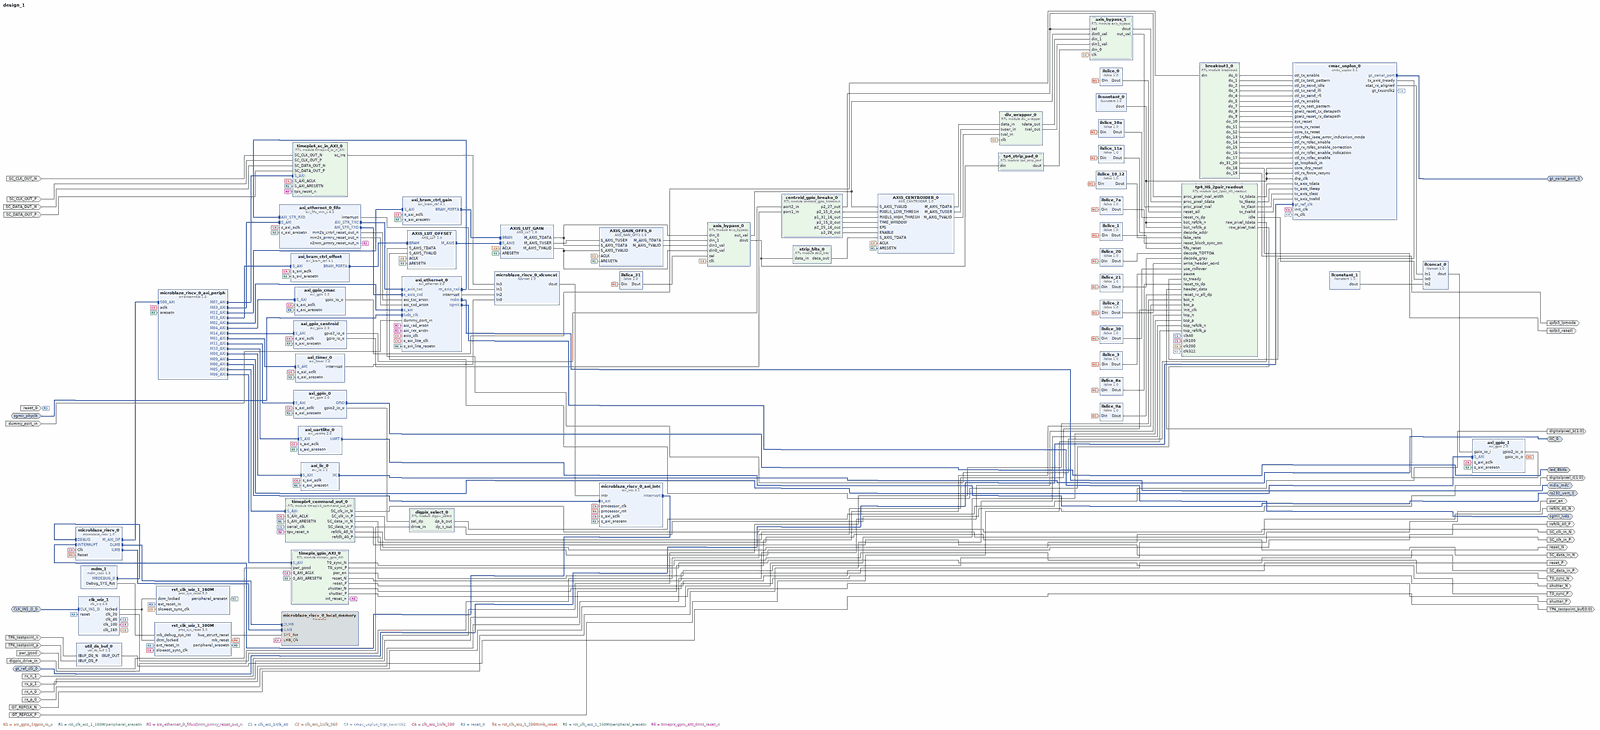
[diagram p0: block diagram of the top level, whole]
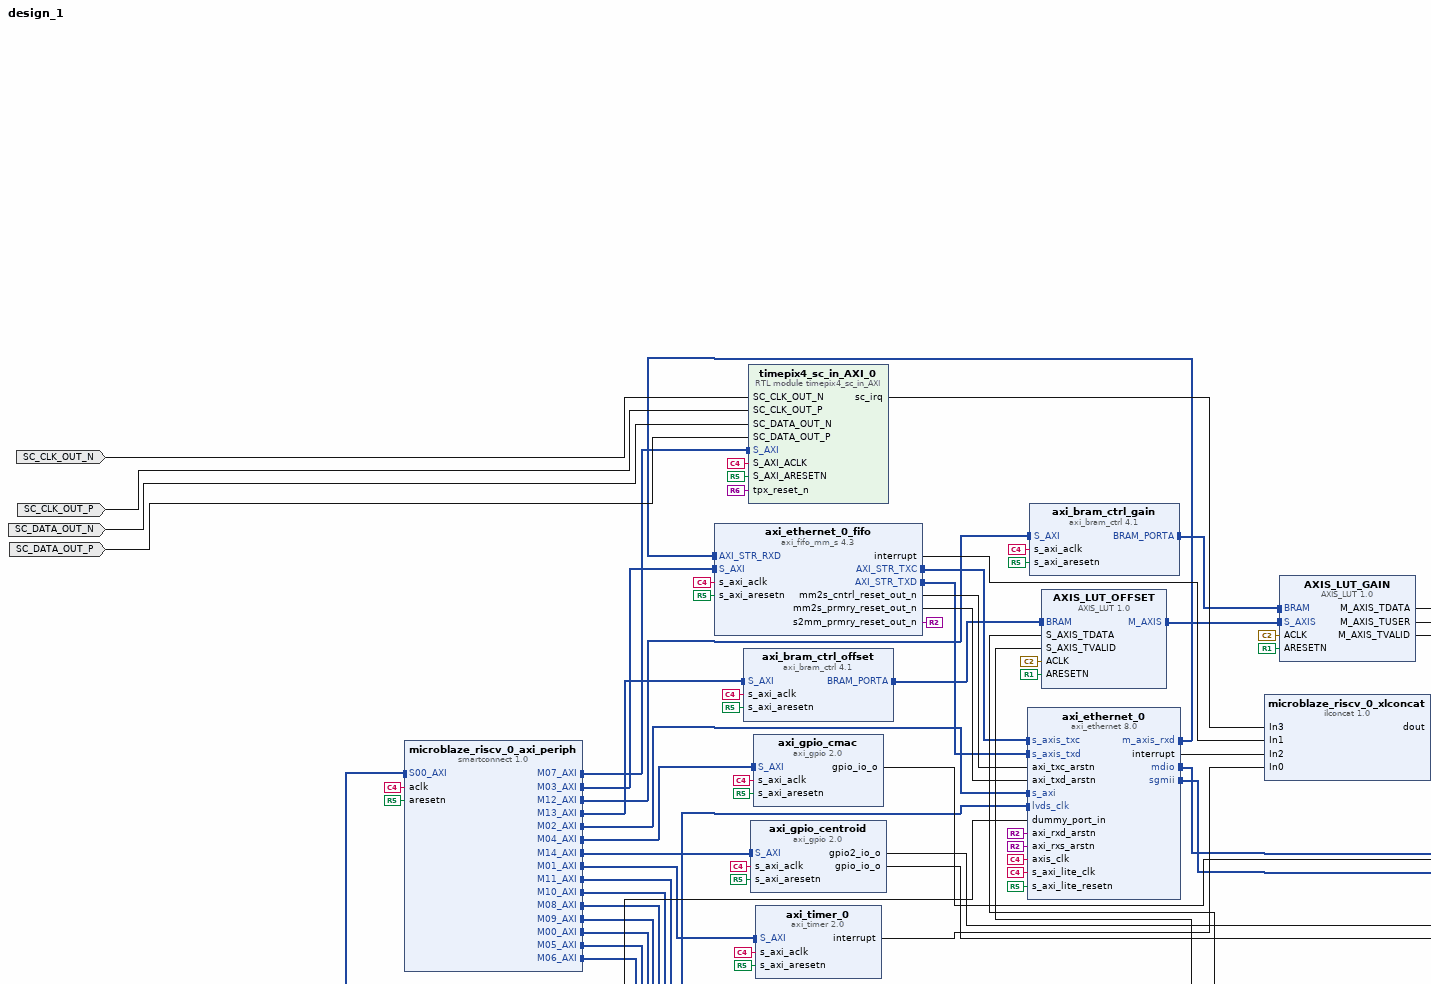
[diagram p1: block diagram of the top level, upper left part]
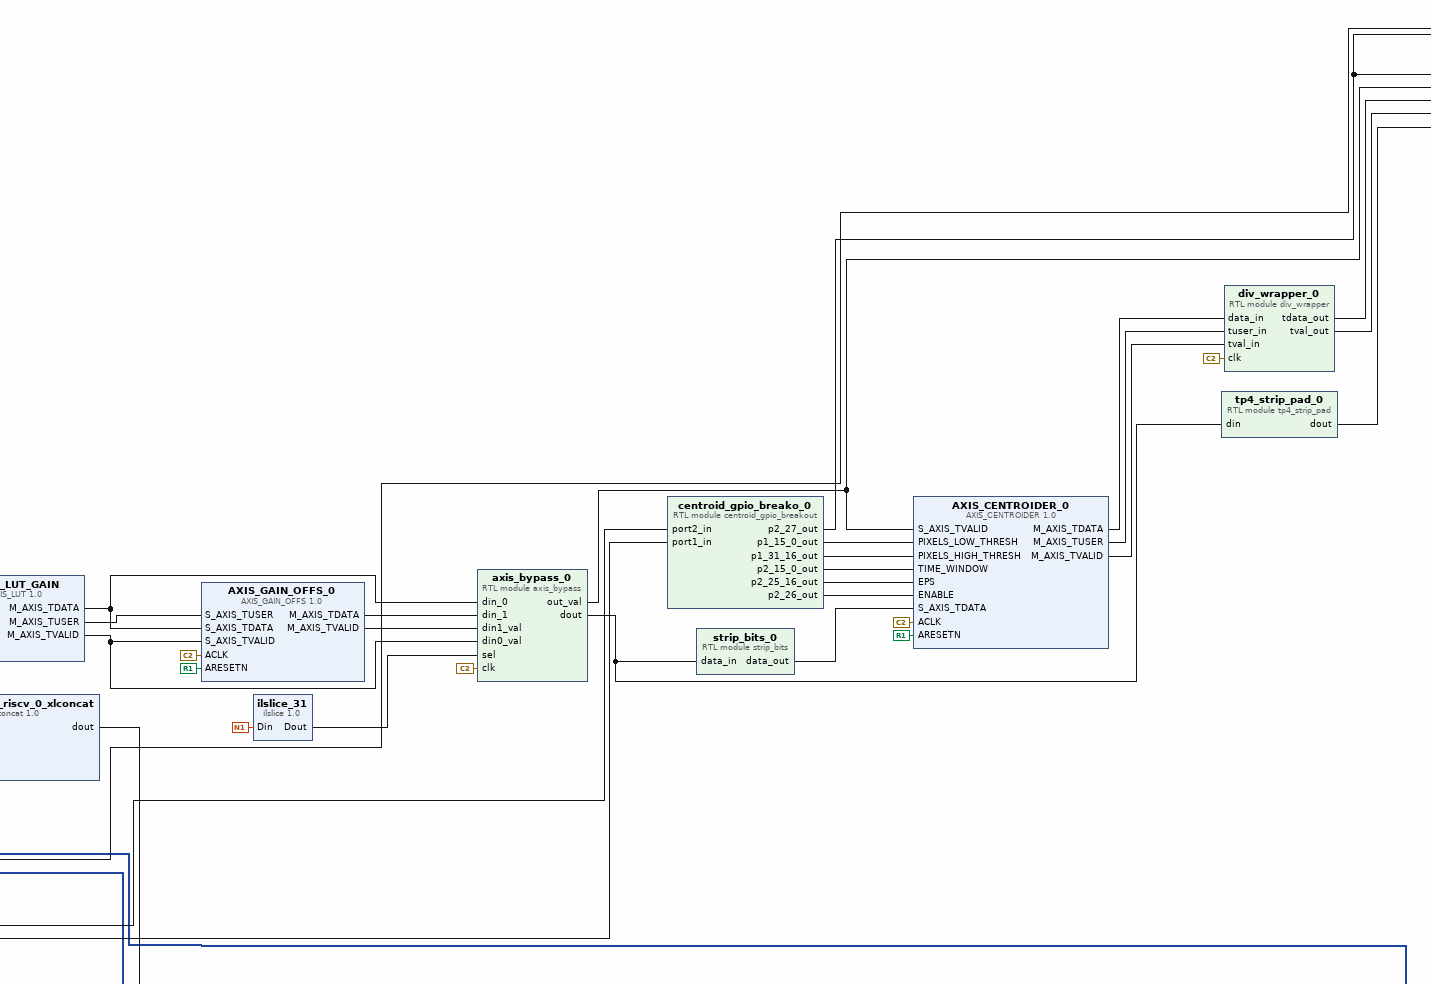
[diagram p2: block diagram of the top level, upper centre part]
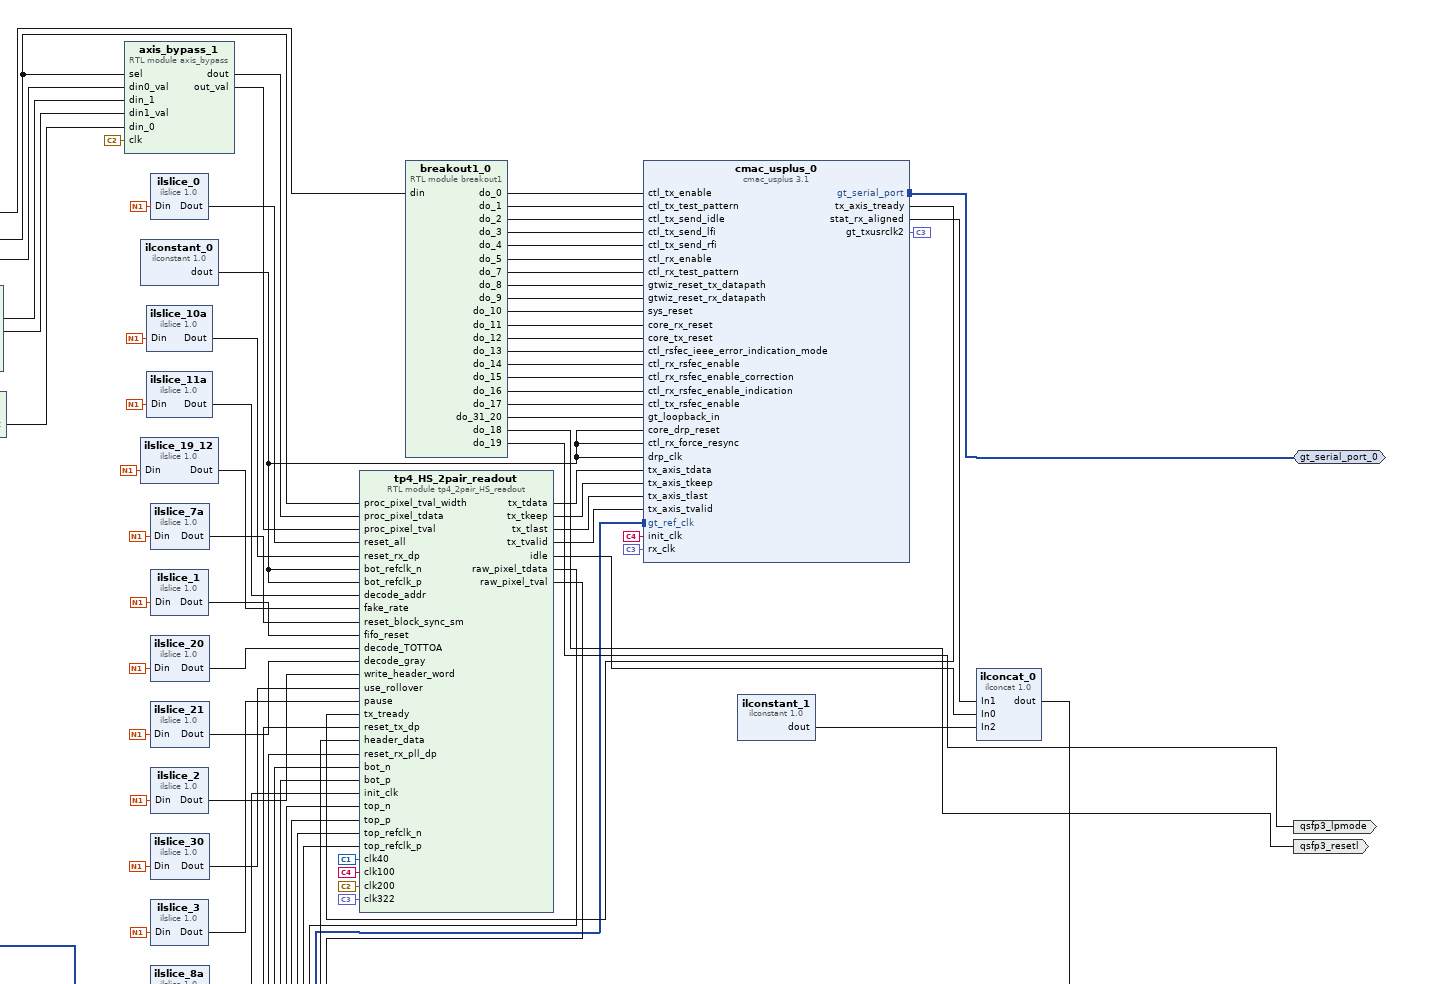
[diagram p3: block diagram of the top level, upper right part]
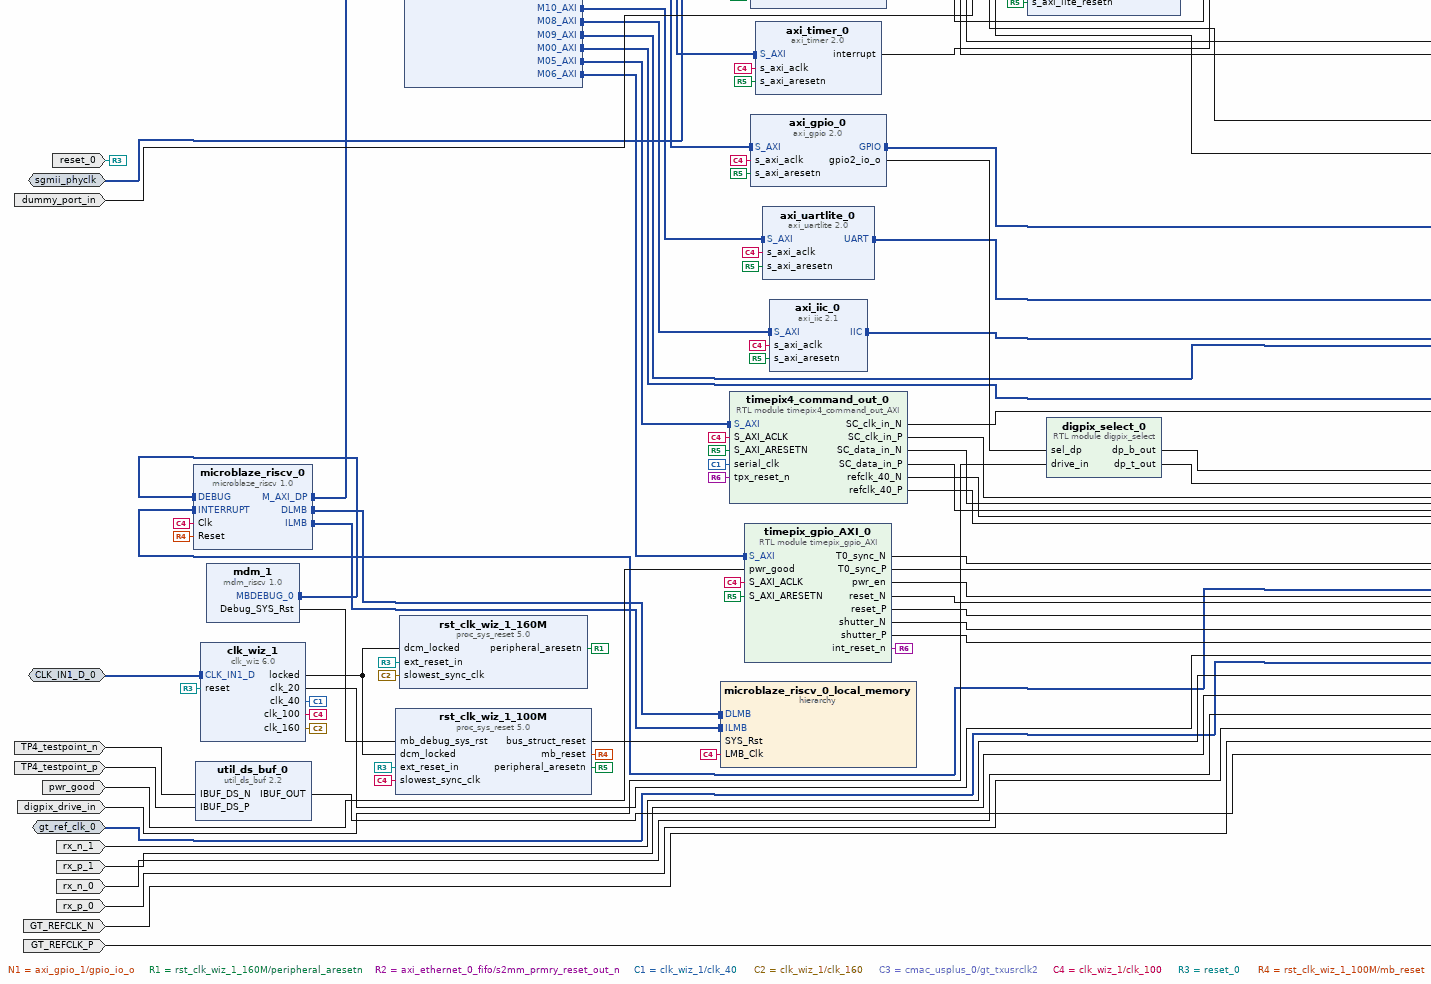
[diagram p4: block diagram of the top level, lower left part]
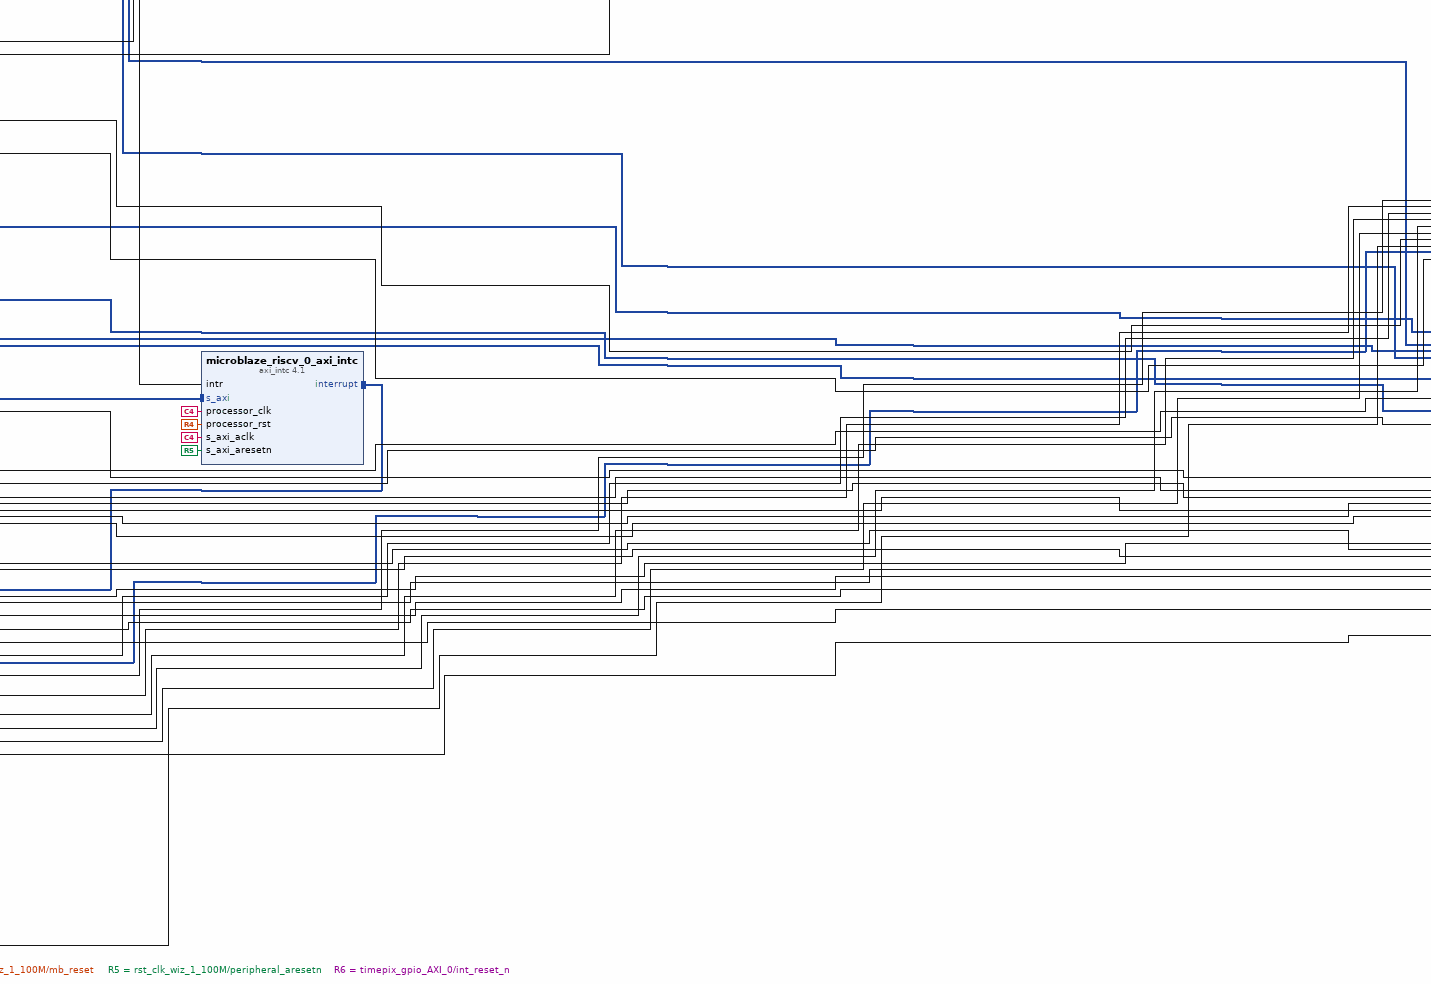
[diagram p5: block diagram of the top level, lower centre part]
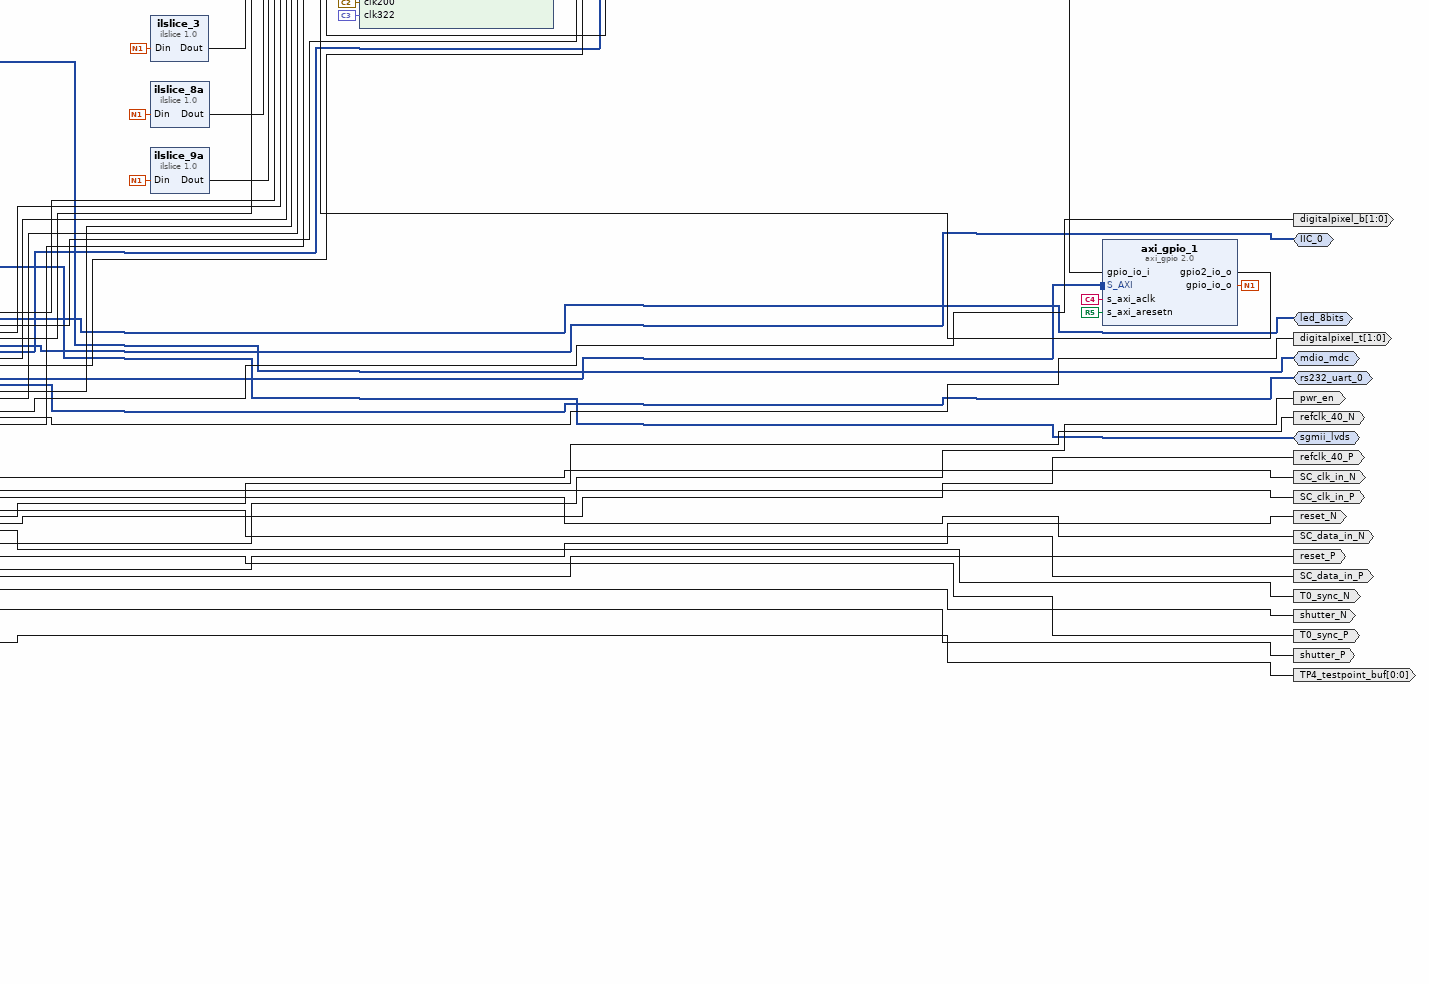
[diagram p6: block diagram of the top level, lower right part]
# Vivado block design design_1, xcvu37p-fsvh2892-2L-e, Vivado 2025.2
create_bd_design design_1

create_bd_intf_port -mode Slave -vlnv xilinx.com:interface:diff_clock_rtl:1.0 CLK_IN1_D_0
create_bd_intf_port -mode Slave -vlnv xilinx.com:interface:diff_clock_rtl:1.0 sgmii_phyclk
set_property -dict {CONFIG.FREQ_HZ 625000000} [get_bd_intf_ports sgmii_phyclk]
create_bd_intf_port -mode Master -vlnv xilinx.com:interface:mdio_rtl:1.0 mdio_mdc
create_bd_intf_port -mode Master -vlnv xilinx.com:interface:sgmii_rtl:1.0 sgmii_lvds
create_bd_intf_port -mode Slave -vlnv xilinx.com:interface:diff_clock_rtl:1.0 gt_ref_clk_0
set_property -dict {CONFIG.FREQ_HZ 156250000} [get_bd_intf_ports gt_ref_clk_0]
create_bd_intf_port -mode Master -vlnv xilinx.com:interface:gt_rtl:1.0 gt_serial_port_0
create_bd_intf_port -mode Master -vlnv xilinx.com:interface:iic_rtl:1.0 IIC_0
create_bd_intf_port -mode Master -vlnv xilinx.com:interface:uart_rtl:1.0 rs232_uart_0
create_bd_intf_port -mode Master -vlnv xilinx.com:interface:gpio_rtl:1.0 led_8bits
create_bd_port -dir I -type rst reset_0
set_property -dict {CONFIG.POLARITY ACTIVE_HIGH} [get_bd_ports reset_0]
create_bd_port -dir I -type rst dummy_port_in
set_property -dict {CONFIG.POLARITY ACTIVE_HIGH} [get_bd_ports dummy_port_in]
create_bd_port -dir O qsfp3_resetl
create_bd_port -dir O qsfp3_lpmode
create_bd_port -dir O refclk_40_P
create_bd_port -dir O SC_clk_in_P
create_bd_port -dir O SC_clk_in_N
create_bd_port -dir O SC_data_in_P
create_bd_port -dir O SC_data_in_N
create_bd_port -dir O refclk_40_N
create_bd_port -dir O -from 1 -to 0 digitalpixel_b
create_bd_port -dir O -type rst reset_P
create_bd_port -dir O shutter_P
create_bd_port -dir O pwr_en
create_bd_port -dir O T0_sync_N
create_bd_port -dir O T0_sync_P
create_bd_port -dir O -type rst reset_N
create_bd_port -dir O shutter_N
create_bd_port -dir I SC_DATA_OUT_P
create_bd_port -dir I SC_CLK_OUT_N
create_bd_port -dir I SC_DATA_OUT_N
create_bd_port -dir I SC_CLK_OUT_P
create_bd_port -dir I pwr_good
create_bd_port -dir I GT_REFCLK_P
create_bd_port -dir I rx_p_1
create_bd_port -dir I rx_n_1
create_bd_port -dir I rx_p_0
create_bd_port -dir I rx_n_0
create_bd_port -dir I GT_REFCLK_N
create_bd_port -dir I TP4_testpoint_p
create_bd_port -dir I TP4_testpoint_n
create_bd_port -dir O -from 0 -to 0 -type clk TP4_testpoint_buf
create_bd_port -dir O -from 1 -to 0 digitalpixel_t
create_bd_port -dir I digpix_drive_in

create_bd_cell -type ip -vlnv xilinx.com:ip:microblaze_riscv:1.0 microblaze_riscv_0
set_property -dict [list \
  CONFIG.C_DEBUG_ENABLED 1 \
  CONFIG.C_DEBUG_TRACE_SIZE 8192 \
  CONFIG.C_D_AXI 1 \
  CONFIG.C_D_LMB 1 \
  CONFIG.C_I_LMB 1 \
  CONFIG.C_MISALIGNED_EXCEPTIONS 0 \
  CONFIG.C_M_AXI_D_BUS_EXCEPTION 0 \
  CONFIG.G_TEMPLATE_LIST 1 \
] [get_bd_cells microblaze_riscv_0]
create_bd_cell -type hier microblaze_riscv_0_local_memory
create_bd_cell -type ip -vlnv xilinx.com:ip:smartconnect:1.0 microblaze_riscv_0_axi_periph
set_property -dict {CONFIG.NUM_MI 15 CONFIG.NUM_SI 1} [get_bd_cells microblaze_riscv_0_axi_periph]
create_bd_cell -type ip -vlnv xilinx.com:ip:axi_intc:4.1 microblaze_riscv_0_axi_intc
set_property -dict {CONFIG.C_HAS_FAST 1} [get_bd_cells microblaze_riscv_0_axi_intc]
create_bd_cell -type inline_hdl -vlnv xilinx.com:inline_hdl:ilconcat:1.0 microblaze_riscv_0_xlconcat
set_property -dict {CONFIG.NUM_PORTS 4} [get_bd_cells microblaze_riscv_0_xlconcat]
create_bd_cell -type ip -vlnv xilinx.com:ip:mdm_riscv:1.0 mdm_1
create_bd_cell -type ip -vlnv xilinx.com:ip:clk_wiz:6.0 clk_wiz_1
set_property -dict [list \
  CONFIG.CLKOUT1_JITTER 144.719 \
  CONFIG.CLKOUT1_PHASE_ERROR 114.212 \
  CONFIG.CLKOUT1_USED true \
  CONFIG.CLKOUT2_JITTER 174.629 \
  CONFIG.CLKOUT2_PHASE_ERROR 114.212 \
  CONFIG.CLKOUT2_REQUESTED_OUT_FREQ 40.000 \
  CONFIG.CLKOUT2_USED true \
  CONFIG.CLKOUT3_JITTER 200.312 \
  CONFIG.CLKOUT3_PHASE_ERROR 114.212 \
  CONFIG.CLKOUT3_REQUESTED_OUT_FREQ 20.000 \
  CONFIG.CLKOUT3_USED true \
  CONFIG.CLKOUT4_JITTER 131.841 \
  CONFIG.CLKOUT4_PHASE_ERROR 114.212 \
  CONFIG.CLKOUT4_REQUESTED_OUT_FREQ 160.000 \
  CONFIG.CLKOUT4_USED true \
  CONFIG.CLK_IN1_BOARD_INTERFACE default_100mhz_clk \
  CONFIG.CLK_OUT1_PORT clk_100 \
  CONFIG.CLK_OUT2_PORT clk_40 \
  CONFIG.CLK_OUT3_PORT clk_20 \
  CONFIG.CLK_OUT4_PORT clk_160 \
  CONFIG.MMCM_CLKFBOUT_MULT_F 8.000 \
  CONFIG.MMCM_CLKIN1_PERIOD 10.0 \
  CONFIG.MMCM_CLKIN2_PERIOD 10.0 \
  CONFIG.MMCM_CLKOUT0_DIVIDE_F 8.000 \
  CONFIG.MMCM_CLKOUT1_DIVIDE 20 \
  CONFIG.MMCM_CLKOUT2_DIVIDE 40 \
  CONFIG.MMCM_CLKOUT3_DIVIDE 5 \
  CONFIG.NUM_OUT_CLKS 4 \
  CONFIG.PRIM_SOURCE Differential_clock_capable_pin \
  CONFIG.RESET_BOARD_INTERFACE reset \
] [get_bd_cells clk_wiz_1]
create_bd_cell -type ip -vlnv xilinx.com:ip:proc_sys_reset:5.0 rst_clk_wiz_1_100M
set_property -dict {CONFIG.RESET_BOARD_INTERFACE reset} [get_bd_cells rst_clk_wiz_1_100M]
create_bd_cell -type ip -vlnv xilinx.com:ip:axi_timer:2.0 axi_timer_0
set_property -dict {CONFIG.enable_timer2 0} [get_bd_cells axi_timer_0]
create_bd_cell -type ip -vlnv xilinx.com:ip:axi_ethernet:8.0 axi_ethernet_0
set_property -dict [list \
  CONFIG.DIFFCLK_BOARD_INTERFACE sgmii_phyclk \
  CONFIG.ETHERNET_BOARD_INTERFACE sgmii_lvds \
  CONFIG.MDIO_BOARD_INTERFACE mdio_mdc \
  CONFIG.PHYRST_BOARD_INTERFACE Custom \
  CONFIG.PHYRST_BOARD_INTERFACE_DUMMY_PORT dummy_port_in \
  CONFIG.lvdsclkrate 625 \
  CONFIG.rxlane0_placement DIFF_PAIR_2 \
  CONFIG.rxnibblebitslice0used false \
  CONFIG.txlane0_placement DIFF_PAIR_1 \
] [get_bd_cells axi_ethernet_0]
create_bd_cell -type ip -vlnv xilinx.com:ip:axi_fifo_mm_s:4.3 axi_ethernet_0_fifo
set_property -dict [list \
  CONFIG.C_HAS_AXIS_TKEEP true \
  CONFIG.C_RX_FIFO_DEPTH 4096 \
  CONFIG.C_RX_FIFO_PE_THRESHOLD 10 \
  CONFIG.C_RX_FIFO_PF_THRESHOLD 4000 \
  CONFIG.C_TX_FIFO_DEPTH 4096 \
  CONFIG.C_TX_FIFO_PE_THRESHOLD 10 \
  CONFIG.C_TX_FIFO_PF_THRESHOLD 4000 \
] [get_bd_cells axi_ethernet_0_fifo]
create_bd_cell -type ip -vlnv xilinx.com:ip:cmac_usplus:3.1 cmac_usplus_0
set_property -dict [list \
  CONFIG.DIFFCLK_BOARD_INTERFACE qsfp3_156mhz \
  CONFIG.ETHERNET_BOARD_INTERFACE qsfp3_4x \
  CONFIG.GT_REF_CLK_FREQ 156.25 \
  CONFIG.INCLUDE_RS_FEC 1 \
  CONFIG.RX_FLOW_CONTROL 0 \
  CONFIG.TX_FLOW_CONTROL 0 \
  CONFIG.USER_INTERFACE AXIS \
  CONFIG.USE_BOARD_FLOW true \
] [get_bd_cells cmac_usplus_0]
create_bd_cell -type inline_hdl -vlnv xilinx.com:inline_hdl:ilconstant:1.0 ilconstant_0
set_property -dict {CONFIG.CONST_VAL 0} [get_bd_cells ilconstant_0]
create_bd_cell -type module -reference breakout1 breakout1_0
create_bd_cell -type ip -vlnv xilinx.com:ip:axi_gpio:2.0 axi_gpio_cmac
create_bd_cell -type module -reference timepix4_command_out_AXI timepix4_command_out_0
create_bd_cell -type module -reference timepix_gpio_AXI timepix_gpio_AXI_0
create_bd_cell -type module -reference timepix4_sc_in_AXI timepix4_sc_in_AXI_0
create_bd_cell -type ip -vlnv xilinx.com:ip:axi_iic:2.1 axi_iic_0
create_bd_cell -type ip -vlnv xilinx.com:ip:util_ds_buf:2.2 util_ds_buf_0
create_bd_cell -type module -reference tp4_2pair_HS_readout tp4_HS_2pair_readout
create_bd_cell -type inline_hdl -vlnv xilinx.com:inline_hdl:ilslice:1.0 ilslice_0
create_bd_cell -type inline_hdl -vlnv xilinx.com:inline_hdl:ilslice:1.0 ilslice_7a
set_property -dict {CONFIG.DIN_FROM 7 CONFIG.DIN_TO 7} [get_bd_cells ilslice_7a]
create_bd_cell -type inline_hdl -vlnv xilinx.com:inline_hdl:ilslice:1.0 ilslice_8a
set_property -dict {CONFIG.DIN_FROM 8 CONFIG.DIN_TO 8} [get_bd_cells ilslice_8a]
create_bd_cell -type inline_hdl -vlnv xilinx.com:inline_hdl:ilslice:1.0 ilslice_9a
set_property -dict {CONFIG.DIN_FROM 9 CONFIG.DIN_TO 9} [get_bd_cells ilslice_9a]
create_bd_cell -type inline_hdl -vlnv xilinx.com:inline_hdl:ilslice:1.0 ilslice_10a
set_property -dict {CONFIG.DIN_FROM 10 CONFIG.DIN_TO 10} [get_bd_cells ilslice_10a]
create_bd_cell -type inline_hdl -vlnv xilinx.com:inline_hdl:ilslice:1.0 ilslice_1
set_property -dict {CONFIG.DIN_FROM 1 CONFIG.DIN_TO 1} [get_bd_cells ilslice_1]
create_bd_cell -type inline_hdl -vlnv xilinx.com:inline_hdl:ilslice:1.0 ilslice_11a
set_property -dict {CONFIG.DIN_FROM 11 CONFIG.DIN_TO 11} [get_bd_cells ilslice_11a]
create_bd_cell -type inline_hdl -vlnv xilinx.com:inline_hdl:ilslice:1.0 ilslice_20
set_property -dict {CONFIG.DIN_FROM 20 CONFIG.DIN_TO 20} [get_bd_cells ilslice_20]
create_bd_cell -type inline_hdl -vlnv xilinx.com:inline_hdl:ilslice:1.0 ilslice_2
set_property -dict {CONFIG.DIN_FROM 2 CONFIG.DIN_TO 2} [get_bd_cells ilslice_2]
create_bd_cell -type inline_hdl -vlnv xilinx.com:inline_hdl:ilslice:1.0 ilslice_3
set_property -dict {CONFIG.DIN_FROM 3 CONFIG.DIN_TO 3} [get_bd_cells ilslice_3]
create_bd_cell -type inline_hdl -vlnv xilinx.com:inline_hdl:ilslice:1.0 ilslice_19_12
set_property -dict {CONFIG.DIN_FROM 19 CONFIG.DIN_TO 12} [get_bd_cells ilslice_19_12]
create_bd_cell -type ip -vlnv xilinx.com:ip:axi_gpio:2.0 axi_gpio_1
set_property -dict {CONFIG.C_IS_DUAL 1} [get_bd_cells axi_gpio_1]
create_bd_cell -type inline_hdl -vlnv xilinx.com:inline_hdl:ilconcat:1.0 ilconcat_0
set_property -dict {CONFIG.IN2_WIDTH 30 CONFIG.NUM_PORTS 3} [get_bd_cells ilconcat_0]
create_bd_cell -type inline_hdl -vlnv xilinx.com:inline_hdl:ilconstant:1.0 ilconstant_1
set_property -dict {CONFIG.CONST_VAL 0 CONFIG.CONST_WIDTH 30} [get_bd_cells ilconstant_1]
create_bd_cell -type ip -vlnv xilinx.com:ip:axi_uartlite:2.0 axi_uartlite_0
set_property -dict [list \
  CONFIG.C_BAUDRATE 115200 \
  CONFIG.UARTLITE_BOARD_INTERFACE rs232_uart_0 \
  CONFIG.USE_BOARD_FLOW true \
] [get_bd_cells axi_uartlite_0]
create_bd_cell -type ip -vlnv xilinx.com:ip:axi_gpio:2.0 axi_gpio_0
set_property -dict [list \
  CONFIG.C_ALL_OUTPUTS_2 1 \
  CONFIG.C_GPIO2_WIDTH 4 \
  CONFIG.C_IS_DUAL 1 \
  CONFIG.GPIO_BOARD_INTERFACE led_8bits \
  CONFIG.USE_BOARD_FLOW true \
] [get_bd_cells axi_gpio_0]
create_bd_cell -type module -reference digpix_select digpix_select_0
create_bd_cell -type inline_hdl -vlnv xilinx.com:inline_hdl:ilslice:1.0 ilslice_21
set_property -dict {CONFIG.DIN_FROM 21 CONFIG.DIN_TO 21} [get_bd_cells ilslice_21]
create_bd_cell -type inline_hdl -vlnv xilinx.com:inline_hdl:ilslice:1.0 ilslice_30
set_property -dict {CONFIG.DIN_FROM 30 CONFIG.DIN_TO 30} [get_bd_cells ilslice_30]
create_bd_cell -type ip -vlnv sequentlogic.com:Common:AXIS_LUT:1.0 AXIS_LUT_OFFSET
set_property -dict [list \
  CONFIG.C_AXIS_DATA_WIDTH 96 \
  CONFIG.C_AXIS_USER_WIDTH 0 \
  CONFIG.C_INDEX_START 78 \
  CONFIG.C_INDEX_WIDTH 18 \
  CONFIG.C_VALUE_WIDTH 16 \
] [get_bd_cells AXIS_LUT_OFFSET]
create_bd_cell -type ip -vlnv sequentlogic.com:Common:AXIS_LUT:1.0 AXIS_LUT_GAIN
set_property -dict [list \
  CONFIG.C_AXIS_DATA_WIDTH 96 \
  CONFIG.C_AXIS_USER_WIDTH 16 \
  CONFIG.C_CTRL_ADDR_WIDTH 19 \
  CONFIG.C_INDEX_START 78 \
  CONFIG.C_INDEX_WIDTH 18 \
  CONFIG.C_VALUE_WIDTH 16 \
] [get_bd_cells AXIS_LUT_GAIN]
create_bd_cell -type ip -vlnv xilinx.com:ip:axi_bram_ctrl:4.1 axi_bram_ctrl_offset
set_property -dict {CONFIG.SINGLE_PORT_BRAM 1} [get_bd_cells axi_bram_ctrl_offset]
create_bd_cell -type ip -vlnv xilinx.com:ip:axi_bram_ctrl:4.1 axi_bram_ctrl_gain
set_property -dict {CONFIG.SINGLE_PORT_BRAM 1} [get_bd_cells axi_bram_ctrl_gain]
create_bd_cell -type ip -vlnv sequentlogic.com:Common:AXIS_GAIN_OFFS:1.0 AXIS_GAIN_OFFS_0
set_property -dict [list \
  CONFIG.C_AXIS_DATA_WIDTH 96 \
  CONFIG.C_AXIS_USER_WIDTH 32 \
  CONFIG.C_FIELD_WIDTH 17 \
] [get_bd_cells AXIS_GAIN_OFFS_0]
create_bd_cell -type module -reference axis_bypass axis_bypass_0
set_property -dict {CONFIG.BUS_WIDTH 96} [get_bd_cells axis_bypass_0]
create_bd_cell -type inline_hdl -vlnv xilinx.com:inline_hdl:ilslice:1.0 ilslice_31
set_property -dict {CONFIG.DIN_FROM 31 CONFIG.DIN_TO 31} [get_bd_cells ilslice_31]
create_bd_cell -type module -reference tp4_strip_pad tp4_strip_pad_0
create_bd_cell -type module -reference strip_bits strip_bits_0
create_bd_cell -type module -reference axis_bypass axis_bypass_1
set_property -dict {CONFIG.BUS_WIDTH 128} [get_bd_cells axis_bypass_1]
create_bd_cell -type ip -vlnv sequentlogic.com:Common:AXIS_CENTROIDER:1.0 AXIS_CENTROIDER_0
set_property -dict [list \
  CONFIG.C_NUM_PIXELS_WIDTH 16 \
  CONFIG.C_PAD_IN_WIDTH 0 \
  CONFIG.C_PAD_OUT_WIDTH 0 \
  CONFIG.C_SIZE 64 \
  CONFIG.C_TOA_WIDTH 55 \
  CONFIG.C_XY_SUM_WIDTH 32 \
  CONFIG.C_XY_WIDTH 9 \
] [get_bd_cells AXIS_CENTROIDER_0]
create_bd_cell -type ip -vlnv xilinx.com:ip:axi_gpio:2.0 axi_gpio_centroid
set_property -dict {CONFIG.C_ALL_OUTPUTS 1 CONFIG.C_ALL_OUTPUTS_2 1 CONFIG.C_IS_DUAL 1} [get_bd_cells axi_gpio_centroid]
create_bd_cell -type module -reference centroid_gpio_breakout centroid_gpio_breako_0
create_bd_cell -type module -reference div_wrapper div_wrapper_0
create_bd_cell -type ip -vlnv xilinx.com:ip:proc_sys_reset:5.0 rst_clk_wiz_1_160M
set_property -dict {CONFIG.RESET_BOARD_INTERFACE reset} [get_bd_cells rst_clk_wiz_1_160M]

# ---- hierarchy /microblaze_riscv_0_local_memory ----
current_bd_instance /microblaze_riscv_0_local_memory
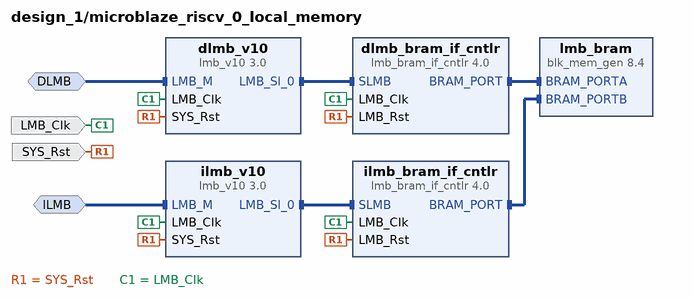
[diagram p7: block diagram inside /microblaze_riscv_0_local_memory]
create_bd_intf_pin -mode MirroredMaster -vlnv xilinx.com:interface:lmb_rtl:1.0 DLMB
create_bd_intf_pin -mode MirroredMaster -vlnv xilinx.com:interface:lmb_rtl:1.0 ILMB
create_bd_pin -dir I -type clk LMB_Clk
create_bd_pin -dir I -type rst SYS_Rst

create_bd_cell -type ip -vlnv xilinx.com:ip:lmb_v10:3.0 dlmb_v10
create_bd_cell -type ip -vlnv xilinx.com:ip:lmb_v10:3.0 ilmb_v10
create_bd_cell -type ip -vlnv xilinx.com:ip:lmb_bram_if_cntlr:4.0 dlmb_bram_if_cntlr
set_property -dict {CONFIG.C_ECC 0} [get_bd_cells dlmb_bram_if_cntlr]
create_bd_cell -type ip -vlnv xilinx.com:ip:lmb_bram_if_cntlr:4.0 ilmb_bram_if_cntlr
set_property -dict {CONFIG.C_ECC 0} [get_bd_cells ilmb_bram_if_cntlr]
create_bd_cell -type ip -vlnv xilinx.com:ip:blk_mem_gen:8.4 lmb_bram
set_property -dict {CONFIG.Memory_Type True_Dual_Port_RAM CONFIG.use_bram_block BRAM_Controller} [get_bd_cells lmb_bram]

# ---- connections ----

current_bd_instance /microblaze_riscv_0_local_memory
connect_bd_intf_net -intf_net microblaze_riscv_0_dlmb [get_bd_intf_pins dlmb_v10/LMB_M] [get_bd_intf_pins DLMB]
connect_bd_intf_net -intf_net microblaze_riscv_0_dlmb_bus [get_bd_intf_pins dlmb_v10/LMB_Sl_0] [get_bd_intf_pins dlmb_bram_if_cntlr/SLMB]
connect_bd_intf_net -intf_net microblaze_riscv_0_dlmb_cntlr [get_bd_intf_pins dlmb_bram_if_cntlr/BRAM_PORT] [get_bd_intf_pins lmb_bram/BRAM_PORTA]
connect_bd_intf_net -intf_net microblaze_riscv_0_ilmb [get_bd_intf_pins ilmb_v10/LMB_M] [get_bd_intf_pins ILMB]
connect_bd_intf_net -intf_net microblaze_riscv_0_ilmb_bus [get_bd_intf_pins ilmb_v10/LMB_Sl_0] [get_bd_intf_pins ilmb_bram_if_cntlr/SLMB]
connect_bd_intf_net -intf_net microblaze_riscv_0_ilmb_cntlr [get_bd_intf_pins ilmb_bram_if_cntlr/BRAM_PORT] [get_bd_intf_pins lmb_bram/BRAM_PORTB]
connect_bd_net [get_bd_pins SYS_Rst] \
  [get_bd_pins dlmb_v10/SYS_Rst] [get_bd_pins dlmb_bram_if_cntlr/LMB_Rst] [get_bd_pins ilmb_v10/SYS_Rst] \
  [get_bd_pins ilmb_bram_if_cntlr/LMB_Rst]
connect_bd_net -net microblaze_riscv_0_Clk [get_bd_pins LMB_Clk] \
  [get_bd_pins dlmb_v10/LMB_Clk] [get_bd_pins dlmb_bram_if_cntlr/LMB_Clk] [get_bd_pins ilmb_v10/LMB_Clk] \
  [get_bd_pins ilmb_bram_if_cntlr/LMB_Clk]
set_property HDL_ATTRIBUTE.BMM_INFO_ADDRESS_SPACE {byte  0x00000000 32 > design_1 microblaze_riscv_0_local_memory/lmb_bram} [get_bd_cells dlmb_bram_if_cntlr]
set_property HDL_ATTRIBUTE.KEEP_HIERARCHY yes [get_bd_cells dlmb_bram_if_cntlr]

current_bd_instance /
connect_bd_intf_net [get_bd_intf_pins AXIS_LUT_OFFSET/M_AXIS] [get_bd_intf_pins AXIS_LUT_GAIN/S_AXIS]
connect_bd_intf_net -intf_net CLK_IN1_D_0_1 [get_bd_intf_ports CLK_IN1_D_0] [get_bd_intf_pins clk_wiz_1/CLK_IN1_D]
connect_bd_intf_net [get_bd_intf_pins axi_bram_ctrl_gain/BRAM_PORTA] [get_bd_intf_pins AXIS_LUT_GAIN/BRAM]
connect_bd_intf_net [get_bd_intf_pins axi_bram_ctrl_offset/BRAM_PORTA] [get_bd_intf_pins AXIS_LUT_OFFSET/BRAM]
connect_bd_intf_net [get_bd_intf_pins axi_ethernet_0_fifo/AXI_STR_TXC] [get_bd_intf_pins axi_ethernet_0/s_axis_txc]
connect_bd_intf_net [get_bd_intf_pins axi_ethernet_0_fifo/AXI_STR_TXD] [get_bd_intf_pins axi_ethernet_0/s_axis_txd]
connect_bd_intf_net [get_bd_intf_pins axi_ethernet_0_fifo/AXI_STR_RXD] [get_bd_intf_pins axi_ethernet_0/m_axis_rxd]
connect_bd_intf_net [get_bd_intf_ports mdio_mdc] [get_bd_intf_pins axi_ethernet_0/mdio]
connect_bd_intf_net [get_bd_intf_ports sgmii_lvds] [get_bd_intf_pins axi_ethernet_0/sgmii]
connect_bd_intf_net [get_bd_intf_ports led_8bits] [get_bd_intf_pins axi_gpio_0/GPIO]
connect_bd_intf_net [get_bd_intf_ports IIC_0] [get_bd_intf_pins axi_iic_0/IIC]
connect_bd_intf_net [get_bd_intf_ports rs232_uart_0] [get_bd_intf_pins axi_uartlite_0/UART]
connect_bd_intf_net [get_bd_intf_ports gt_serial_port_0] [get_bd_intf_pins cmac_usplus_0/gt_serial_port]
connect_bd_intf_net -intf_net gt_ref_clk_0_1 [get_bd_intf_ports gt_ref_clk_0] [get_bd_intf_pins cmac_usplus_0/gt_ref_clk]
connect_bd_intf_net -intf_net microblaze_riscv_0_axi_dp [get_bd_intf_pins microblaze_riscv_0_axi_periph/S00_AXI] [get_bd_intf_pins microblaze_riscv_0/M_AXI_DP]
connect_bd_intf_net [get_bd_intf_pins microblaze_riscv_0_axi_periph/M01_AXI] [get_bd_intf_pins axi_timer_0/S_AXI]
connect_bd_intf_net [get_bd_intf_pins microblaze_riscv_0_axi_periph/M02_AXI] [get_bd_intf_pins axi_ethernet_0/s_axi]
connect_bd_intf_net [get_bd_intf_pins microblaze_riscv_0_axi_periph/M03_AXI] [get_bd_intf_pins axi_ethernet_0_fifo/S_AXI]
connect_bd_intf_net [get_bd_intf_pins microblaze_riscv_0_axi_periph/M04_AXI] [get_bd_intf_pins axi_gpio_cmac/S_AXI]
connect_bd_intf_net [get_bd_intf_pins microblaze_riscv_0_axi_periph/M05_AXI] [get_bd_intf_pins timepix4_command_out_0/S_AXI]
connect_bd_intf_net [get_bd_intf_pins microblaze_riscv_0_axi_periph/M06_AXI] [get_bd_intf_pins timepix_gpio_AXI_0/S_AXI]
connect_bd_intf_net [get_bd_intf_pins microblaze_riscv_0_axi_periph/M07_AXI] [get_bd_intf_pins timepix4_sc_in_AXI_0/S_AXI]
connect_bd_intf_net [get_bd_intf_pins microblaze_riscv_0_axi_periph/M08_AXI] [get_bd_intf_pins axi_iic_0/S_AXI]
connect_bd_intf_net [get_bd_intf_pins microblaze_riscv_0_axi_periph/M09_AXI] [get_bd_intf_pins axi_gpio_1/S_AXI]
connect_bd_intf_net [get_bd_intf_pins microblaze_riscv_0_axi_periph/M10_AXI] [get_bd_intf_pins axi_uartlite_0/S_AXI]
connect_bd_intf_net [get_bd_intf_pins microblaze_riscv_0_axi_periph/M11_AXI] [get_bd_intf_pins axi_gpio_0/S_AXI]
connect_bd_intf_net [get_bd_intf_pins microblaze_riscv_0_axi_periph/M12_AXI] [get_bd_intf_pins axi_bram_ctrl_gain/S_AXI]
connect_bd_intf_net [get_bd_intf_pins microblaze_riscv_0_axi_periph/M13_AXI] [get_bd_intf_pins axi_bram_ctrl_offset/S_AXI]
connect_bd_intf_net [get_bd_intf_pins microblaze_riscv_0_axi_periph/M14_AXI] [get_bd_intf_pins axi_gpio_centroid/S_AXI]
connect_bd_intf_net [get_bd_intf_pins mdm_1/MBDEBUG_0] [get_bd_intf_pins microblaze_riscv_0/DEBUG]
connect_bd_intf_net [get_bd_intf_pins microblaze_riscv_0/DLMB] [get_bd_intf_pins microblaze_riscv_0_local_memory/DLMB]
connect_bd_intf_net [get_bd_intf_pins microblaze_riscv_0/ILMB] [get_bd_intf_pins microblaze_riscv_0_local_memory/ILMB]
connect_bd_intf_net -intf_net microblaze_riscv_0_intc_axi [get_bd_intf_pins microblaze_riscv_0_axi_periph/M00_AXI] [get_bd_intf_pins microblaze_riscv_0_axi_intc/s_axi]
connect_bd_intf_net [get_bd_intf_pins microblaze_riscv_0_axi_intc/interrupt] [get_bd_intf_pins microblaze_riscv_0/INTERRUPT]
connect_bd_intf_net [get_bd_intf_ports sgmii_phyclk] [get_bd_intf_pins axi_ethernet_0/lvds_clk]
connect_bd_net [get_bd_pins AXIS_CENTROIDER_0/M_AXIS_TDATA] [get_bd_pins div_wrapper_0/data_in]
connect_bd_net [get_bd_pins AXIS_CENTROIDER_0/M_AXIS_TUSER] [get_bd_pins div_wrapper_0/tuser_in]
connect_bd_net [get_bd_pins AXIS_CENTROIDER_0/M_AXIS_TVALID] [get_bd_pins div_wrapper_0/tval_in]
connect_bd_net [get_bd_pins AXIS_GAIN_OFFS_0/M_AXIS_TDATA] [get_bd_pins axis_bypass_0/din_1]
connect_bd_net [get_bd_pins AXIS_GAIN_OFFS_0/M_AXIS_TVALID] [get_bd_pins axis_bypass_0/din1_val]
connect_bd_net [get_bd_pins AXIS_LUT_GAIN/M_AXIS_TDATA] [get_bd_pins AXIS_GAIN_OFFS_0/S_AXIS_TDATA] [get_bd_pins axis_bypass_0/din_0]
connect_bd_net [get_bd_pins AXIS_LUT_GAIN/M_AXIS_TUSER] [get_bd_pins AXIS_GAIN_OFFS_0/S_AXIS_TUSER]
connect_bd_net [get_bd_pins AXIS_LUT_GAIN/M_AXIS_TVALID] [get_bd_pins AXIS_GAIN_OFFS_0/S_AXIS_TVALID] [get_bd_pins axis_bypass_0/din0_val]
connect_bd_net [get_bd_pins axi_gpio_1/gpio_io_o] \
  [get_bd_pins ilslice_0/Din] [get_bd_pins ilslice_19_12/Din] [get_bd_pins ilslice_3/Din] [get_bd_pins ilslice_2/Din] \
  [get_bd_pins ilslice_20/Din] [get_bd_pins ilslice_11a/Din] [get_bd_pins ilslice_1/Din] [get_bd_pins ilslice_10a/Din] \
  [get_bd_pins ilslice_9a/Din] [get_bd_pins ilslice_8a/Din] [get_bd_pins ilslice_7a/Din] [get_bd_pins ilslice_21/Din] \
  [get_bd_pins ilslice_30/Din] [get_bd_pins ilslice_31/Din]
connect_bd_net [get_bd_pins rst_clk_wiz_1_160M/peripheral_aresetn] \
  [get_bd_pins AXIS_LUT_OFFSET/ARESETN] [get_bd_pins AXIS_LUT_GAIN/ARESETN] [get_bd_pins AXIS_GAIN_OFFS_0/ARESETN] \
  [get_bd_pins AXIS_CENTROIDER_0/ARESETN]
connect_bd_net -net SC_CLK_OUT_N_0_1 [get_bd_ports SC_CLK_OUT_N] [get_bd_pins timepix4_sc_in_AXI_0/SC_CLK_OUT_N]
connect_bd_net -net SC_CLK_OUT_P_0_1 [get_bd_ports SC_CLK_OUT_P] [get_bd_pins timepix4_sc_in_AXI_0/SC_CLK_OUT_P]
connect_bd_net -net SC_DATA_OUT_N_0_1 [get_bd_ports SC_DATA_OUT_N] [get_bd_pins timepix4_sc_in_AXI_0/SC_DATA_OUT_N]
connect_bd_net -net SC_DATA_OUT_P_0_1 [get_bd_ports SC_DATA_OUT_P] [get_bd_pins timepix4_sc_in_AXI_0/SC_DATA_OUT_P]
connect_bd_net [get_bd_ports TP4_testpoint_n] [get_bd_pins util_ds_buf_0/IBUF_DS_N]
connect_bd_net [get_bd_ports TP4_testpoint_p] [get_bd_pins util_ds_buf_0/IBUF_DS_P]
connect_bd_net [get_bd_pins axi_ethernet_0_fifo/interrupt] [get_bd_pins microblaze_riscv_0_xlconcat/In1]
connect_bd_net [get_bd_pins axi_ethernet_0_fifo/mm2s_cntrl_reset_out_n] [get_bd_pins axi_ethernet_0/axi_txc_arstn]
connect_bd_net [get_bd_pins axi_ethernet_0_fifo/mm2s_prmry_reset_out_n] [get_bd_pins axi_ethernet_0/axi_txd_arstn]
connect_bd_net [get_bd_pins axi_ethernet_0_fifo/s2mm_prmry_reset_out_n] \
  [get_bd_pins axi_ethernet_0/axi_rxd_arstn] [get_bd_pins axi_ethernet_0/axi_rxs_arstn]
connect_bd_net [get_bd_pins axi_ethernet_0/interrupt] [get_bd_pins microblaze_riscv_0_xlconcat/In2]
connect_bd_net [get_bd_pins axi_gpio_0/gpio2_io_o] [get_bd_pins digpix_select_0/sel_dp]
connect_bd_net [get_bd_pins axi_gpio_1/gpio2_io_o] [get_bd_pins tp4_HS_2pair_readout/header_data]
connect_bd_net -net axi_gpio_2_gpio2_io_o [get_bd_pins axi_gpio_centroid/gpio2_io_o] [get_bd_pins centroid_gpio_breako_0/port2_in]
connect_bd_net -net axi_gpio_2_gpio_io_o [get_bd_pins axi_gpio_centroid/gpio_io_o] [get_bd_pins centroid_gpio_breako_0/port1_in]
connect_bd_net [get_bd_pins axi_gpio_cmac/gpio_io_o] [get_bd_pins breakout1_0/din]
connect_bd_net [get_bd_pins axi_timer_0/interrupt] [get_bd_pins microblaze_riscv_0_xlconcat/In0]
connect_bd_net [get_bd_pins axis_bypass_0/dout] [get_bd_pins strip_bits_0/data_in] [get_bd_pins tp4_strip_pad_0/din]
connect_bd_net [get_bd_pins axis_bypass_0/out_val] [get_bd_pins axis_bypass_1/din0_val] [get_bd_pins AXIS_CENTROIDER_0/S_AXIS_TVALID]
connect_bd_net [get_bd_pins axis_bypass_1/dout] [get_bd_pins tp4_HS_2pair_readout/proc_pixel_tdata]
connect_bd_net [get_bd_pins axis_bypass_1/out_val] [get_bd_pins tp4_HS_2pair_readout/proc_pixel_tval]
connect_bd_net -net bot_n_0_1 [get_bd_ports rx_n_1] [get_bd_pins tp4_HS_2pair_readout/bot_n]
connect_bd_net -net bot_p_0_1 [get_bd_ports rx_p_1] [get_bd_pins tp4_HS_2pair_readout/bot_p]
connect_bd_net [get_bd_pins breakout1_0/do_0] [get_bd_pins cmac_usplus_0/ctl_tx_enable]
connect_bd_net [get_bd_pins breakout1_0/do_1] [get_bd_pins cmac_usplus_0/ctl_tx_test_pattern]
connect_bd_net [get_bd_pins breakout1_0/do_2] [get_bd_pins cmac_usplus_0/ctl_tx_send_idle]
connect_bd_net [get_bd_pins breakout1_0/do_3] [get_bd_pins cmac_usplus_0/ctl_tx_send_lfi]
connect_bd_net [get_bd_pins breakout1_0/do_4] [get_bd_pins cmac_usplus_0/ctl_tx_send_rfi]
connect_bd_net [get_bd_pins breakout1_0/do_5] [get_bd_pins cmac_usplus_0/ctl_rx_enable]
connect_bd_net [get_bd_pins breakout1_0/do_7] [get_bd_pins cmac_usplus_0/ctl_rx_test_pattern]
connect_bd_net [get_bd_pins breakout1_0/do_8] [get_bd_pins cmac_usplus_0/gtwiz_reset_tx_datapath]
connect_bd_net [get_bd_pins breakout1_0/do_9] [get_bd_pins cmac_usplus_0/gtwiz_reset_rx_datapath]
connect_bd_net [get_bd_pins breakout1_0/do_10] [get_bd_pins cmac_usplus_0/sys_reset]
connect_bd_net [get_bd_pins breakout1_0/do_11] [get_bd_pins cmac_usplus_0/core_rx_reset]
connect_bd_net [get_bd_pins breakout1_0/do_12] [get_bd_pins cmac_usplus_0/core_tx_reset]
connect_bd_net [get_bd_pins breakout1_0/do_13] [get_bd_pins cmac_usplus_0/ctl_rsfec_ieee_error_indication_mode]
connect_bd_net [get_bd_pins breakout1_0/do_14] [get_bd_pins cmac_usplus_0/ctl_rx_rsfec_enable]
connect_bd_net [get_bd_pins breakout1_0/do_15] [get_bd_pins cmac_usplus_0/ctl_rx_rsfec_enable_correction]
connect_bd_net [get_bd_pins breakout1_0/do_16] [get_bd_pins cmac_usplus_0/ctl_rx_rsfec_enable_indication]
connect_bd_net [get_bd_pins breakout1_0/do_17] [get_bd_pins cmac_usplus_0/ctl_tx_rsfec_enable]
connect_bd_net [get_bd_pins breakout1_0/do_18] [get_bd_ports qsfp3_resetl]
connect_bd_net [get_bd_pins breakout1_0/do_19] [get_bd_ports qsfp3_lpmode]
connect_bd_net [get_bd_pins breakout1_0/do_31_20] [get_bd_pins cmac_usplus_0/gt_loopback_in]
connect_bd_net [get_bd_pins centroid_gpio_breako_0/p1_15_0_out] [get_bd_pins AXIS_CENTROIDER_0/PIXELS_LOW_THRESH]
connect_bd_net [get_bd_pins centroid_gpio_breako_0/p1_31_16_out] [get_bd_pins AXIS_CENTROIDER_0/PIXELS_HIGH_THRESH]
connect_bd_net [get_bd_pins centroid_gpio_breako_0/p2_15_0_out] [get_bd_pins AXIS_CENTROIDER_0/TIME_WINDOW]
connect_bd_net [get_bd_pins centroid_gpio_breako_0/p2_25_16_out] [get_bd_pins AXIS_CENTROIDER_0/EPS]
connect_bd_net [get_bd_pins centroid_gpio_breako_0/p2_26_out] [get_bd_pins AXIS_CENTROIDER_0/ENABLE]
connect_bd_net [get_bd_pins centroid_gpio_breako_0/p2_27_out] [get_bd_pins axis_bypass_1/sel] [get_bd_pins tp4_HS_2pair_readout/proc_pixel_tval_width]
connect_bd_net [get_bd_pins clk_wiz_1/clk_20] [get_bd_pins tp4_HS_2pair_readout/init_clk]
connect_bd_net [get_bd_pins clk_wiz_1/clk_40] [get_bd_pins timepix4_command_out_0/serial_clk] [get_bd_pins tp4_HS_2pair_readout/clk40]
connect_bd_net [get_bd_pins clk_wiz_1/clk_160] \
  [get_bd_pins tp4_HS_2pair_readout/clk200] [get_bd_pins div_wrapper_0/clk] [get_bd_pins axis_bypass_1/clk] \
  [get_bd_pins AXIS_CENTROIDER_0/ACLK] [get_bd_pins axis_bypass_0/clk] [get_bd_pins AXIS_GAIN_OFFS_0/ACLK] \
  [get_bd_pins AXIS_LUT_GAIN/ACLK] [get_bd_pins AXIS_LUT_OFFSET/ACLK] [get_bd_pins rst_clk_wiz_1_160M/slowest_sync_clk]
connect_bd_net [get_bd_pins clk_wiz_1/locked] [get_bd_pins rst_clk_wiz_1_100M/dcm_locked] [get_bd_pins rst_clk_wiz_1_160M/dcm_locked]
connect_bd_net [get_bd_pins cmac_usplus_0/gt_txusrclk2] [get_bd_pins cmac_usplus_0/rx_clk] [get_bd_pins tp4_HS_2pair_readout/clk322]
connect_bd_net [get_bd_pins cmac_usplus_0/stat_rx_aligned] [get_bd_pins ilconcat_0/In1]
connect_bd_net [get_bd_pins cmac_usplus_0/tx_axis_tready] [get_bd_pins tp4_HS_2pair_readout/tx_tready]
connect_bd_net [get_bd_pins digpix_select_0/dp_b_out] [get_bd_ports digitalpixel_b]
connect_bd_net [get_bd_pins digpix_select_0/dp_t_out] [get_bd_ports digitalpixel_t]
connect_bd_net [get_bd_pins div_wrapper_0/tdata_out] [get_bd_pins axis_bypass_1/din_1]
connect_bd_net [get_bd_pins div_wrapper_0/tval_out] [get_bd_pins axis_bypass_1/din1_val]
connect_bd_net -net drive_in_0_1 [get_bd_ports digpix_drive_in] [get_bd_pins digpix_select_0/drive_in]
connect_bd_net [get_bd_ports dummy_port_in] [get_bd_pins axi_ethernet_0/dummy_port_in]
connect_bd_net [get_bd_pins ilconcat_0/dout] [get_bd_pins axi_gpio_1/gpio_io_i]
connect_bd_net [get_bd_pins ilconstant_0/dout] \
  [get_bd_pins cmac_usplus_0/drp_clk] [get_bd_pins cmac_usplus_0/core_drp_reset] \
  [get_bd_pins cmac_usplus_0/ctl_rx_force_resync] [get_bd_pins tp4_HS_2pair_readout/bot_refclk_p] \
  [get_bd_pins tp4_HS_2pair_readout/bot_refclk_n]
connect_bd_net [get_bd_pins ilconstant_1/dout] [get_bd_pins ilconcat_0/In2]
connect_bd_net [get_bd_pins ilslice_0/Dout] [get_bd_pins tp4_HS_2pair_readout/reset_all]
connect_bd_net [get_bd_pins ilslice_10a/Dout] [get_bd_pins tp4_HS_2pair_readout/reset_rx_dp]
connect_bd_net [get_bd_pins ilslice_11a/Dout] [get_bd_pins tp4_HS_2pair_readout/decode_addr]
connect_bd_net [get_bd_pins ilslice_19_12/Dout] [get_bd_pins tp4_HS_2pair_readout/fake_rate]
connect_bd_net -net ilslice_1_Dout [get_bd_pins ilslice_7a/Dout] [get_bd_pins tp4_HS_2pair_readout/reset_block_sync_sm]
connect_bd_net [get_bd_pins ilslice_1/Dout] [get_bd_pins tp4_HS_2pair_readout/fifo_reset]
connect_bd_net [get_bd_pins ilslice_20/Dout] [get_bd_pins tp4_HS_2pair_readout/decode_TOTTOA]
connect_bd_net [get_bd_pins ilslice_21/Dout] [get_bd_pins tp4_HS_2pair_readout/decode_gray]
connect_bd_net [get_bd_pins ilslice_2/Dout] [get_bd_pins tp4_HS_2pair_readout/write_header_word]
connect_bd_net [get_bd_pins ilslice_30/Dout] [get_bd_pins tp4_HS_2pair_readout/use_rollover]
connect_bd_net [get_bd_pins ilslice_31/Dout] [get_bd_pins axis_bypass_0/sel]
connect_bd_net [get_bd_pins ilslice_3/Dout] [get_bd_pins tp4_HS_2pair_readout/pause]
connect_bd_net [get_bd_pins ilslice_8a/Dout] [get_bd_pins tp4_HS_2pair_readout/reset_tx_dp]
connect_bd_net [get_bd_pins ilslice_9a/Dout] [get_bd_pins tp4_HS_2pair_readout/reset_rx_pll_dp]
connect_bd_net [get_bd_pins mdm_1/Debug_SYS_Rst] [get_bd_pins rst_clk_wiz_1_100M/mb_debug_sys_rst]
connect_bd_net -net microblaze_riscv_0_Clk [get_bd_pins clk_wiz_1/clk_100] \
  [get_bd_pins microblaze_riscv_0/Clk] [get_bd_pins microblaze_riscv_0_axi_periph/aclk] \
  [get_bd_pins microblaze_riscv_0_axi_intc/s_axi_aclk] [get_bd_pins microblaze_riscv_0_axi_intc/processor_clk] \
  [get_bd_pins microblaze_riscv_0_local_memory/LMB_Clk] [get_bd_pins rst_clk_wiz_1_100M/slowest_sync_clk] \
  [get_bd_pins axi_timer_0/s_axi_aclk] [get_bd_pins axi_ethernet_0/s_axi_lite_clk] \
  [get_bd_pins axi_ethernet_0_fifo/s_axi_aclk] [get_bd_pins axi_ethernet_0/axis_clk] [get_bd_pins cmac_usplus_0/init_clk] \
  [get_bd_pins axi_gpio_cmac/s_axi_aclk] [get_bd_pins timepix4_command_out_0/S_AXI_ACLK] \
  [get_bd_pins timepix_gpio_AXI_0/S_AXI_ACLK] [get_bd_pins timepix4_sc_in_AXI_0/S_AXI_ACLK] \
  [get_bd_pins axi_iic_0/s_axi_aclk] [get_bd_pins axi_gpio_1/s_axi_aclk] [get_bd_pins axi_uartlite_0/s_axi_aclk] \
  [get_bd_pins axi_gpio_0/s_axi_aclk] [get_bd_pins tp4_HS_2pair_readout/clk100] [get_bd_pins axi_bram_ctrl_gain/s_axi_aclk] \
  [get_bd_pins axi_bram_ctrl_offset/s_axi_aclk] [get_bd_pins axi_gpio_centroid/s_axi_aclk]
connect_bd_net -net microblaze_riscv_0_intr [get_bd_pins microblaze_riscv_0_xlconcat/dout] [get_bd_pins microblaze_riscv_0_axi_intc/intr]
connect_bd_net -net mod0_idle [get_bd_pins tp4_HS_2pair_readout/idle] [get_bd_pins ilconcat_0/In0]
connect_bd_net -net mod0_tx_tdata [get_bd_pins tp4_HS_2pair_readout/tx_tdata] [get_bd_pins cmac_usplus_0/tx_axis_tdata]
connect_bd_net -net mod0_tx_tkeep [get_bd_pins tp4_HS_2pair_readout/tx_tkeep] [get_bd_pins cmac_usplus_0/tx_axis_tkeep]
connect_bd_net -net mod0_tx_tlast [get_bd_pins tp4_HS_2pair_readout/tx_tlast] [get_bd_pins cmac_usplus_0/tx_axis_tlast]
connect_bd_net -net mod0_tx_tvalid [get_bd_pins tp4_HS_2pair_readout/tx_tvalid] [get_bd_pins cmac_usplus_0/tx_axis_tvalid]
connect_bd_net -net pwr_good_0_1 [get_bd_ports pwr_good] [get_bd_pins timepix_gpio_AXI_0/pwr_good]
connect_bd_net -net reset_0_1 [get_bd_ports reset_0] \
  [get_bd_pins clk_wiz_1/reset] [get_bd_pins rst_clk_wiz_1_100M/ext_reset_in] [get_bd_pins rst_clk_wiz_1_160M/ext_reset_in]
connect_bd_net [get_bd_pins rst_clk_wiz_1_100M/bus_struct_reset] [get_bd_pins microblaze_riscv_0_local_memory/SYS_Rst]
connect_bd_net [get_bd_pins rst_clk_wiz_1_100M/mb_reset] \
  [get_bd_pins microblaze_riscv_0/Reset] [get_bd_pins microblaze_riscv_0_axi_intc/processor_rst]
connect_bd_net [get_bd_pins rst_clk_wiz_1_100M/peripheral_aresetn] \
  [get_bd_pins microblaze_riscv_0_axi_periph/aresetn] [get_bd_pins microblaze_riscv_0_axi_intc/s_axi_aresetn] \
  [get_bd_pins axi_timer_0/s_axi_aresetn] [get_bd_pins axi_ethernet_0/s_axi_lite_resetn] \
  [get_bd_pins axi_ethernet_0_fifo/s_axi_aresetn] [get_bd_pins axi_gpio_cmac/s_axi_aresetn] \
  [get_bd_pins timepix4_command_out_0/S_AXI_ARESETN] [get_bd_pins timepix_gpio_AXI_0/S_AXI_ARESETN] \
  [get_bd_pins timepix4_sc_in_AXI_0/S_AXI_ARESETN] [get_bd_pins axi_iic_0/s_axi_aresetn] \
  [get_bd_pins axi_gpio_1/s_axi_aresetn] [get_bd_pins axi_uartlite_0/s_axi_aresetn] [get_bd_pins axi_gpio_0/s_axi_aresetn] \
  [get_bd_pins axi_bram_ctrl_gain/s_axi_aresetn] [get_bd_pins axi_bram_ctrl_offset/s_axi_aresetn] \
  [get_bd_pins axi_gpio_centroid/s_axi_aresetn]
connect_bd_net [get_bd_pins strip_bits_0/data_out] [get_bd_pins AXIS_CENTROIDER_0/S_AXIS_TDATA]
connect_bd_net [get_bd_pins timepix4_command_out_0/SC_clk_in_N] [get_bd_ports SC_clk_in_N]
connect_bd_net [get_bd_pins timepix4_command_out_0/SC_clk_in_P] [get_bd_ports SC_clk_in_P]
connect_bd_net [get_bd_pins timepix4_command_out_0/SC_data_in_N] [get_bd_ports SC_data_in_N]
connect_bd_net [get_bd_pins timepix4_command_out_0/SC_data_in_P] [get_bd_ports SC_data_in_P]
connect_bd_net [get_bd_pins timepix4_command_out_0/refclk_40_N] [get_bd_ports refclk_40_N]
connect_bd_net [get_bd_pins timepix4_command_out_0/refclk_40_P] [get_bd_ports refclk_40_P]
connect_bd_net [get_bd_pins timepix4_sc_in_AXI_0/sc_irq] [get_bd_pins microblaze_riscv_0_xlconcat/In3]
connect_bd_net [get_bd_pins timepix_gpio_AXI_0/T0_sync_N] [get_bd_ports T0_sync_N]
connect_bd_net [get_bd_pins timepix_gpio_AXI_0/T0_sync_P] [get_bd_ports T0_sync_P]
connect_bd_net [get_bd_pins timepix_gpio_AXI_0/int_reset_n] \
  [get_bd_pins timepix4_command_out_0/tpx_reset_n] [get_bd_pins timepix4_sc_in_AXI_0/tpx_reset_n]
connect_bd_net [get_bd_pins timepix_gpio_AXI_0/pwr_en] [get_bd_ports pwr_en]
connect_bd_net [get_bd_pins timepix_gpio_AXI_0/reset_N] [get_bd_ports reset_N]
connect_bd_net [get_bd_pins timepix_gpio_AXI_0/reset_P] [get_bd_ports reset_P]
connect_bd_net [get_bd_pins timepix_gpio_AXI_0/shutter_N] [get_bd_ports shutter_N]
connect_bd_net [get_bd_pins timepix_gpio_AXI_0/shutter_P] [get_bd_ports shutter_P]
connect_bd_net -net top_n_0_1 [get_bd_ports rx_n_0] [get_bd_pins tp4_HS_2pair_readout/top_n]
connect_bd_net -net top_p_0_1 [get_bd_ports rx_p_0] [get_bd_pins tp4_HS_2pair_readout/top_p]
connect_bd_net -net top_refclk_n_0_1 [get_bd_ports GT_REFCLK_N] [get_bd_pins tp4_HS_2pair_readout/top_refclk_n]
connect_bd_net -net top_refclk_p_0_1 [get_bd_ports GT_REFCLK_P] [get_bd_pins tp4_HS_2pair_readout/top_refclk_p]
connect_bd_net [get_bd_pins tp4_HS_2pair_readout/raw_pixel_tdata] [get_bd_pins AXIS_LUT_OFFSET/S_AXIS_TDATA]
connect_bd_net [get_bd_pins tp4_HS_2pair_readout/raw_pixel_tval] [get_bd_pins AXIS_LUT_OFFSET/S_AXIS_TVALID]
connect_bd_net [get_bd_pins tp4_strip_pad_0/dout] [get_bd_pins axis_bypass_1/din_0]
connect_bd_net [get_bd_pins util_ds_buf_0/IBUF_OUT] [get_bd_ports TP4_testpoint_buf]
set_property HDL_ATTRIBUTE.BMM_INFO_PROCESSOR {riscv > design_1 microblaze_riscv_0_local_memory/dlmb_bram_if_cntlr} [get_bd_cells microblaze_riscv_0]
set_property HDL_ATTRIBUTE.KEEP_HIERARCHY yes [get_bd_cells microblaze_riscv_0]

# ---- address map ----
assign_bd_address -offset 0x00000000 -range 1M -target_address_space [get_bd_addr_spaces microblaze_riscv_0/Data] [get_bd_addr_segs microblaze_riscv_0_local_memory/dlmb_bram_if_cntlr/SLMB/Mem]
assign_bd_address -offset 0x00100000 -range 4K -target_address_space [get_bd_addr_spaces microblaze_riscv_0/Data] [get_bd_addr_segs timepix4_command_out_0/S_AXI/reg0]
assign_bd_address -offset 0x00101000 -range 4K -target_address_space [get_bd_addr_spaces microblaze_riscv_0/Data] [get_bd_addr_segs timepix_gpio_AXI_0/S_AXI/reg0]
assign_bd_address -offset 0x00110000 -range 4K -target_address_space [get_bd_addr_spaces microblaze_riscv_0/Data] [get_bd_addr_segs timepix4_sc_in_AXI_0/S_AXI/reg0]
assign_bd_address -offset 0x40000000 -range 64K -target_address_space [get_bd_addr_spaces microblaze_riscv_0/Data] [get_bd_addr_segs axi_gpio_cmac/S_AXI/Reg]
assign_bd_address -offset 0x40010000 -range 64K -target_address_space [get_bd_addr_spaces microblaze_riscv_0/Data] [get_bd_addr_segs axi_gpio_1/S_AXI/Reg]
assign_bd_address -offset 0x40020000 -range 64K -target_address_space [get_bd_addr_spaces microblaze_riscv_0/Data] [get_bd_addr_segs axi_gpio_0/S_AXI/Reg]
assign_bd_address -offset 0x40030000 -range 64K -target_address_space [get_bd_addr_spaces microblaze_riscv_0/Data] [get_bd_addr_segs axi_gpio_centroid/S_AXI/Reg]
assign_bd_address -offset 0x40600000 -range 64K -target_address_space [get_bd_addr_spaces microblaze_riscv_0/Data] [get_bd_addr_segs axi_uartlite_0/S_AXI/Reg]
assign_bd_address -offset 0x40800000 -range 64K -target_address_space [get_bd_addr_spaces microblaze_riscv_0/Data] [get_bd_addr_segs axi_iic_0/S_AXI/Reg]
assign_bd_address -offset 0x40C00000 -range 256K -target_address_space [get_bd_addr_spaces microblaze_riscv_0/Data] [get_bd_addr_segs axi_ethernet_0/s_axi/Reg0]
assign_bd_address -offset 0x41200000 -range 64K -target_address_space [get_bd_addr_spaces microblaze_riscv_0/Data] [get_bd_addr_segs microblaze_riscv_0_axi_intc/S_AXI/Reg]
assign_bd_address -offset 0x41C00000 -range 64K -target_address_space [get_bd_addr_spaces microblaze_riscv_0/Data] [get_bd_addr_segs axi_timer_0/S_AXI/Reg]
assign_bd_address -offset 0x44A00000 -range 64K -target_address_space [get_bd_addr_spaces microblaze_riscv_0/Data] [get_bd_addr_segs axi_ethernet_0_fifo/S_AXI/Mem0]
assign_bd_address -offset 0xC0000000 -range 512K -target_address_space [get_bd_addr_spaces microblaze_riscv_0/Data] [get_bd_addr_segs axi_bram_ctrl_gain/S_AXI/Mem0]
assign_bd_address -offset 0xC2000000 -range 512K -target_address_space [get_bd_addr_spaces microblaze_riscv_0/Data] [get_bd_addr_segs axi_bram_ctrl_offset/S_AXI/Mem0]
assign_bd_address -offset 0x00000000 -range 1M -target_address_space [get_bd_addr_spaces microblaze_riscv_0/Instruction] [get_bd_addr_segs microblaze_riscv_0_local_memory/ilmb_bram_if_cntlr/SLMB/Mem]

validate_bd_design
save_bd_design
